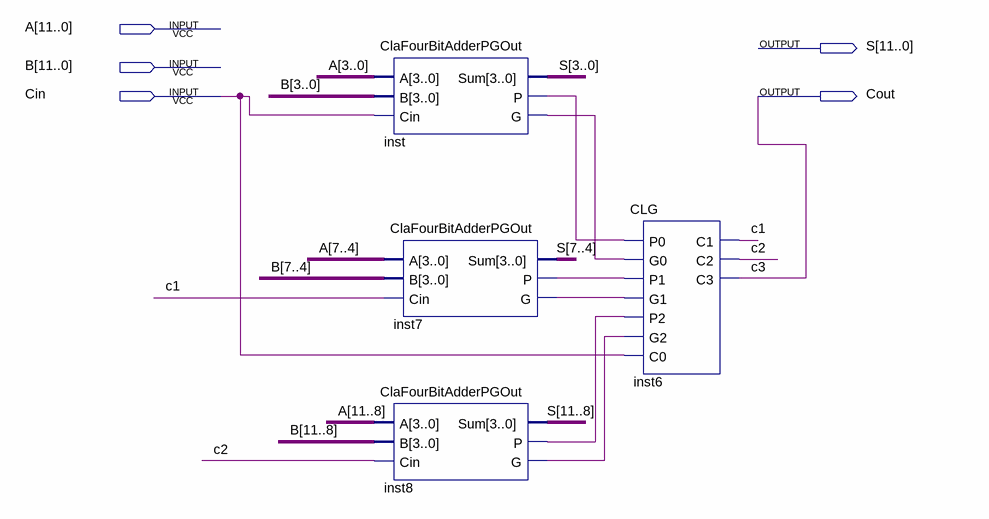
[diagram p0: schematic sheet]
// Quartus schematic Adder12Bit.bdf as structural Verilog: 4 symbols, 5 pins
module Adder12Bit (
  input  [11:0] A,
  input  [11:0] B,
  input  Cin,
  output [11:0] S,
  output Cout
);

  wire c1, c2, inst7_g, inst7_p, inst8_g, inst8_p, inst_g, inst_p;

  ClaFourBitAdderPGOut inst (.A(A[3:0]), .B(B[3:0]), .Cin(Cin), .Sum(S[3:0]), .P(inst_p), .G(inst_g));
  ClaFourBitAdderPGOut inst8 (.A(A[11:8]), .B(B[11:8]), .Cin(c2), .Sum(S[11:8]), .P(inst8_p), .G(inst8_g));
  ClaFourBitAdderPGOut inst7 (.A(A[7:4]), .B(B[7:4]), .Cin(c1), .Sum(S[7:4]), .P(inst7_p), .G(inst7_g));
  CLG inst6 (
    .P0(inst_p), .G0(inst_g), .P1(inst7_p), .G1(inst7_g), .P2(inst8_p), .G2(inst8_g), .C0(Cin), .C1(c1),
    .C2(c2), .C3(Cout));

  // Other names for the same wires on the sheet: c3 = Cout
endmodule
